# Altium project PCB_Project1.PrjPCB
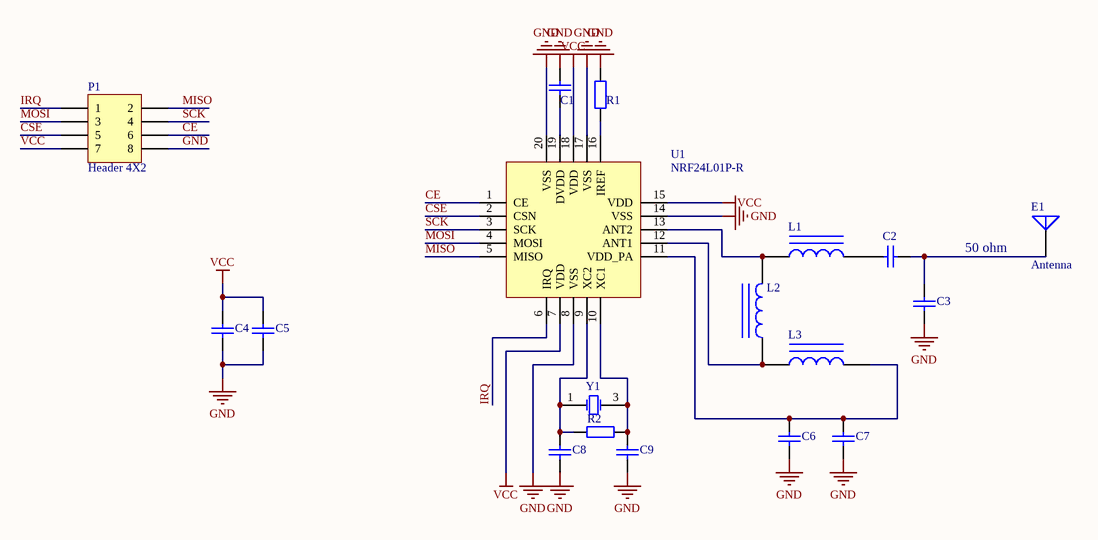
[diagram p0: Sheet1.SchDoc]
1 sheet, 18 parts. Net scope: global (net labels, ports and power ports of the same name join across sheets).
Board files: PCB1.PcbDoc, PCB2.PcbDoc

## Sheet Sheet1.SchDoc
size A4

### Parts
C1  33nF (333) 20% 50V  [0402_C]  (value not drawn)
C2  1.5pF (1R5) 0.25pF 50V  [0402_C]  (value not drawn)
C3  1pF (1R0) 0.25pF 50V  [0402_C]  (value not drawn)
C4  1nF (102) 10% 50V  [0402_C]  (value not drawn)
C5  10nF (103) 10% 50V  [0402_C]  (value not drawn)
C6  2.2nF (222) 10% 50V  [0402_C]  (value not drawn)
C7  4.7pF (4R7) 0.25pF 50V  [0402_C]  (value not drawn)
C8  10pF (100) 5% 50V  [0402_C]  (value not drawn)
C9  10pF (100) 5% 50V  [0402_C]  (value not drawn)
E1  Antenna  [MIFA天线]
L1  3.9nH 3%  [0402_L]  (value not drawn)
L2  8.2nH 5%  [0402_L]  (value not drawn)
L3  2.7nH 0.3nH  [0402_L]  (value not drawn)
P1  Header 4X2  [HDR2X4]
R1  22KΩ (2202) ±1%  [0402_R]  (value not drawn)
R2  1MΩ (1004) ±1%  [0402_R]  (value not drawn)
U1  NRF24L01P-R  [QFN-20_4x4x05P]
Y1  16MHZ 9PF 10PPM  [SMD-3225_4P]  (value not drawn)

### Nets
GND: C1.2 C3.1 C4.1 C5.1 C6.1 C7.1 C8.1 C9.1 P1.8 R1.2 U1.8(VSS) U1.14(VSS) U1.17(VSS) U1.20(VSS)
VCC: C4.2 C5.2 P1.7 U1.7(VDD) U1.15(VDD) U1.18(VDD)
CE: P1.6 U1.1(CE)
CSE: P1.5 U1.2(CSN)
IRQ: P1.1 U1.6(IRQ)
MISO: P1.2 U1.5(MISO)
MOSI: P1.3 U1.4(MOSI)
SCK: P1.4 U1.3(SCK)
NetC1_1: C1.1 U1.19(DVDD)
NetC2_1: C2.1 L1.2
NetC2_2: C2.2 C3.2 E1.1(A)
NetC6_2: C6.2 C7.2 L3.2 U1.11(VDD_PA)
NetC8_2: C8.2 R2.1 U1.9(XC2) Y1.1(OSC1)
NetC9_2: C9.2 R2.2 U1.10(XC1) Y1.3(OSC2)
NetL1_1: L1.1 L2.2 U1.13(ANT2)
NetL2_1: L2.1 L3.1 U1.12(ANT1)
NetR1_1: R1.1 U1.16(IREF)

### Notes on the sheet
- 50 ohm

### Library data of the parts
C1 = 0402 33nF (333) 20% 50V: 贴片电容; ComponentLink1Description: 供应商链接; ComponentLink1URL: http://www.szlcsc.com/product/details_1937.html; Package: 0402; Supplier: LC; SuppliersPartNumber: C1585
C2 = 0402 1.5pF (1R5) 0.25pF 50V: 贴片电容; ComponentLink1Description: 供应商链接; ComponentLink1URL: http://www.szlcsc.com/product/details_1904.html; Package: 0402; Supplier: LC; SuppliersPartNumber: C1552
C3 = 0402 1pF (1R0) 0.25pF 50V: 贴片电容; ComponentLink1Description: 供应商链接; ComponentLink1URL: http://www.szlcsc.com/product/details_1902.html; Package: 0402; Supplier: LC; SuppliersPartNumber: C1550
C4 = 0402 1nF (102) 10% 50V: 贴片电容; ComponentLink1Description: 供应商链接; ComponentLink1URL: http://www.szlcsc.com/product/details_1875.html; Package: 0402; Supplier: LC; SuppliersPartNumber: C1523
C5 = 0402 10nF (103) 10% 50V: 贴片电容; ComponentLink1Description: 供应商链接; ComponentLink1URL: http://www.szlcsc.com/product/details_15869.html; Package: 0402; Supplier: LC; SuppliersPartNumber: C15195
C6 = 0402 2.2nF (222) 10% 50V: 贴片电容; ComponentLink1Description: 供应商链接; ComponentLink1URL: http://www.szlcsc.com/product/details_1883.html; Package: 0402; Supplier: LC; SuppliersPartNumber: C1531
C7 = 0402 4.7pF (4R7) 0.25pF 50V: 贴片电容; ComponentLink1Description: 供应商链接; ComponentLink1URL: http://www.szlcsc.com/product/details_1921.html; Package: 0402; Supplier: LC; SuppliersPartNumber: C1569
C8 C9 = 0402 10pF (100) 5% 50V: 贴片电容; ComponentLink1Description: 供应商链接; ComponentLink1URL: http://www.szlcsc.com/product/details_33914.html; Package: 0402; Supplier: LC; SuppliersPartNumber: C32949
E1 = Antenna: Generic Antenna; Published: 24-Mar-1999; LatestRevisionDate: 17-Jul-2002; LatestRevisionNote: Re-released for DXP Platform.; PackageReference: PIN1; Publisher: Altium Limited
L1 = 0402 3.9nH 3%: 贴片电感; ComponentLink1Description: 供应商链接; ComponentLink1URL: http://www.szlcsc.com/product/details_14690.html; Package: 0402; Supplier: LC; SuppliersPartNumber: C14033
L2 = 0402 8.2nH 5%: 贴片电感; ComponentLink1Description: 供应商链接; ComponentLink1URL: http://www.szlcsc.com/product/details_16890.html; Package: 0402; Supplier: LC; SuppliersPartNumber: C16208
L3 = 0402 2.7nH 0.3nH: 贴片电感; ComponentLink1Description: 供应商链接; ComponentLink1URL: http://www.szlcsc.com/product/details_27872.html; Package: 0402; Supplier: LC; SuppliersPartNumber: C27123
P1 = Header 4X2: Header, 4-Pin, Dual row; LatestRevisionDate: 17-Jul-2002; LatestRevisionNote: Re-released for DXP Platform.; Publisher: Altium Limited
R1 = 0402 22KΩ (2202) 1%: 贴片电阻; ComponentLink1Description: 供应商链接; ComponentLink1URL: http://www.szlcsc.com/product/details_26511.html; Package: 0402; Supplier: LC; SuppliersPartNumber: C25768
R2 = 0402 1MΩ (1004) 1%: 贴片电阻; ComponentLink1Description: 供应商链接; ComponentLink1URL: http://www.szlcsc.com/product/details_26826.html; Package: 0402; Supplier: LC; SuppliersPartNumber: C26083
U1 = NRF24L01P-R_[C8791]: 无线; ComponentLink1Description: 供应商链接; ComponentLink1URL: http://www.szlcsc.com/product/details_9305.html; Package: QFN-20_4x4x05P; Supplier: LC; SuppliersPartNumber: C8791
Y1 = SMD-3225_4P  16MHZ 9PF 10PPM: 贴片晶振; ComponentLink1Description: 供应商链接; ComponentLink1URL: http://www.szlcsc.com/product/details_14393.html; Package: SMD-3225_4P; Supplier: LC; SuppliersPartNumber: C13738